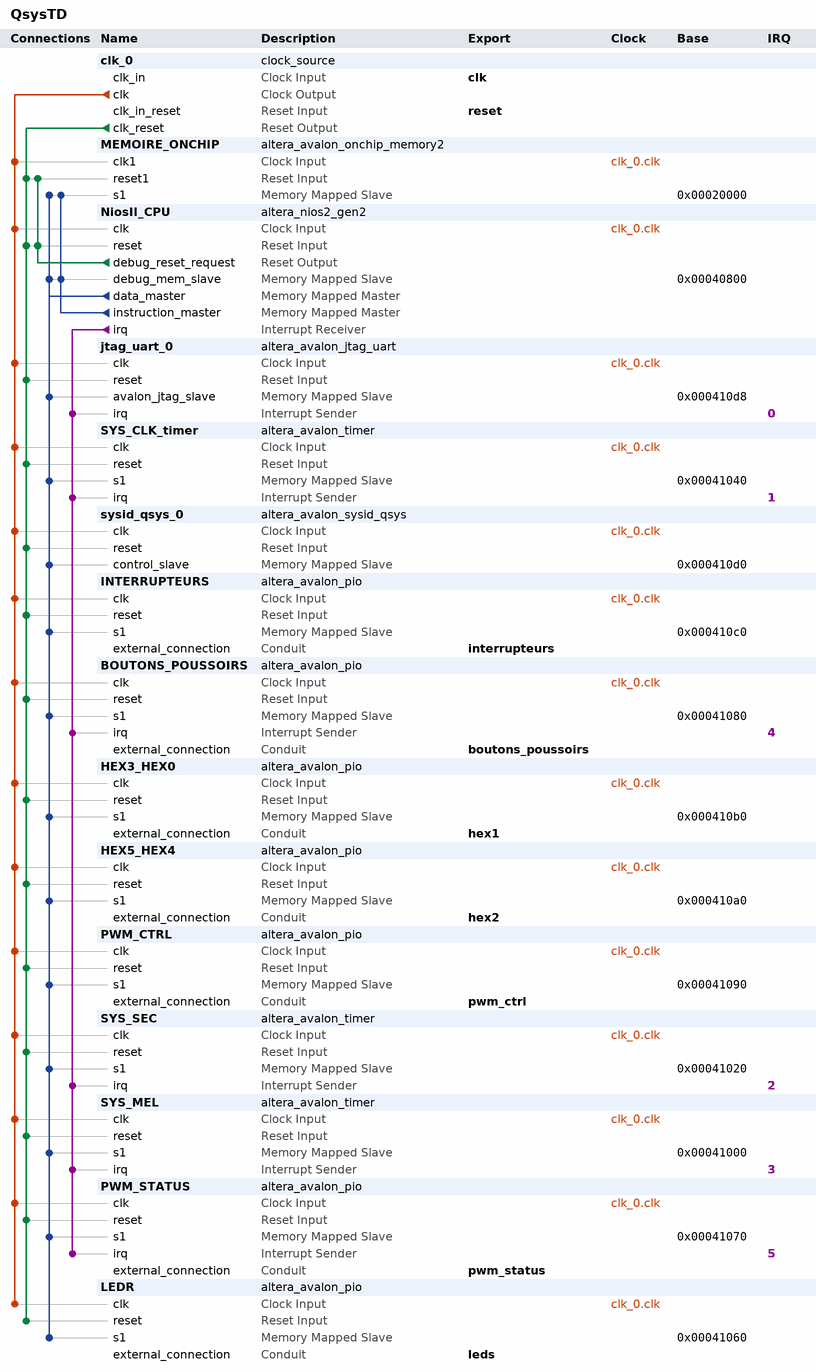
[diagram p0: system contents]
# Platform Designer (Qsys) system QsysTD, MAX 10 10M50DAF484C7G
# Parameters at their usual value, and those the tool derives, are not listed.
package require -exact qsys 18.1
create_system QsysTD
set_project_property DEVICE_FAMILY {MAX 10}
set_project_property DEVICE 10M50DAF484C7G

add_instance clk_0 clock_source 18.1
set_instance_parameter_value clk_0 clockFrequency 50000000

add_instance MEMOIRE_ONCHIP altera_avalon_onchip_memory2 18.1
set_instance_parameter_value MEMOIRE_ONCHIP dataWidth 32
set_instance_parameter_value MEMOIRE_ONCHIP dualPort false
set_instance_parameter_value MEMOIRE_ONCHIP initMemContent false
set_instance_parameter_value MEMOIRE_ONCHIP initializationFileName onchip_mem.hex
set_instance_parameter_value MEMOIRE_ONCHIP memorySize 122880

add_instance NiosII_CPU altera_nios2_gen2 18.1
set_instance_parameter_value NiosII_CPU dcache_size 0
set_instance_parameter_value NiosII_CPU exceptionSlave MEMOIRE_ONCHIP.s1
set_instance_parameter_value NiosII_CPU icache_size 2048
set_instance_parameter_value NiosII_CPU impl Fast
set_instance_parameter_value NiosII_CPU resetSlave MEMOIRE_ONCHIP.s1
set_instance_parameter_value NiosII_CPU setting_branchpredictiontype Static

add_instance jtag_uart_0 altera_avalon_jtag_uart 18.1
set_instance_parameter_value jtag_uart_0 simInteractiveOptions NO_INTERACTIVE_WINDOWS

add_instance SYS_CLK_timer altera_avalon_timer 18.1
set_instance_parameter_value SYS_CLK_timer period 1
set_instance_parameter_value SYS_CLK_timer periodUnits MSEC

add_instance sysid_qsys_0 altera_avalon_sysid_qsys 18.1
set_instance_parameter_value sysid_qsys_0 id 305419896

add_instance INTERRUPTEURS altera_avalon_pio 18.1
set_instance_parameter_value INTERRUPTEURS direction Input
set_instance_parameter_value INTERRUPTEURS width 10

add_instance BOUTONS_POUSSOIRS altera_avalon_pio 18.1
set_instance_parameter_value BOUTONS_POUSSOIRS captureEdge true
set_instance_parameter_value BOUTONS_POUSSOIRS direction Input
set_instance_parameter_value BOUTONS_POUSSOIRS edgeType FALLING
set_instance_parameter_value BOUTONS_POUSSOIRS generateIRQ true
set_instance_parameter_value BOUTONS_POUSSOIRS irqType EDGE
set_instance_parameter_value BOUTONS_POUSSOIRS width 2

add_instance HEX3_HEX0 altera_avalon_pio 18.1
set_instance_parameter_value HEX3_HEX0 direction Output
set_instance_parameter_value HEX3_HEX0 resetValue 4294967295
set_instance_parameter_value HEX3_HEX0 width 32

add_instance HEX5_HEX4 altera_avalon_pio 18.1
set_instance_parameter_value HEX5_HEX4 direction Output
set_instance_parameter_value HEX5_HEX4 resetValue 4294967295
set_instance_parameter_value HEX5_HEX4 width 32

add_instance PWM_CTRL altera_avalon_pio 18.1
set_instance_parameter_value PWM_CTRL direction Output
set_instance_parameter_value PWM_CTRL width 32

add_instance SYS_SEC altera_avalon_timer 18.1
set_instance_parameter_value SYS_SEC period 1
set_instance_parameter_value SYS_SEC periodUnits SEC

add_instance SYS_MEL altera_avalon_timer 18.1
set_instance_parameter_value SYS_MEL period 62.5
set_instance_parameter_value SYS_MEL periodUnits MSEC

add_instance PWM_STATUS altera_avalon_pio 18.1
set_instance_parameter_value PWM_STATUS captureEdge true
set_instance_parameter_value PWM_STATUS direction Input
set_instance_parameter_value PWM_STATUS generateIRQ true
set_instance_parameter_value PWM_STATUS irqType EDGE
set_instance_parameter_value PWM_STATUS width 8

add_instance LEDR altera_avalon_pio 18.1
set_instance_parameter_value LEDR direction Output
set_instance_parameter_value LEDR resetValue 1023
set_instance_parameter_value LEDR width 10

# connections
add_connection clk_0.clk BOUTONS_POUSSOIRS.clk clock
add_connection clk_0.clk HEX3_HEX0.clk clock
add_connection clk_0.clk HEX5_HEX4.clk clock
add_connection clk_0.clk INTERRUPTEURS.clk clock
add_connection clk_0.clk jtag_uart_0.clk clock
add_connection clk_0.clk LEDR.clk clock
add_connection clk_0.clk MEMOIRE_ONCHIP.clk1 clock
add_connection clk_0.clk NiosII_CPU.clk clock
add_connection clk_0.clk PWM_CTRL.clk clock
add_connection clk_0.clk PWM_STATUS.clk clock
add_connection clk_0.clk SYS_CLK_timer.clk clock
add_connection clk_0.clk SYS_MEL.clk clock
add_connection clk_0.clk SYS_SEC.clk clock
add_connection clk_0.clk sysid_qsys_0.clk clock
add_connection clk_0.clk_reset BOUTONS_POUSSOIRS.reset reset
add_connection clk_0.clk_reset HEX3_HEX0.reset reset
add_connection clk_0.clk_reset HEX5_HEX4.reset reset
add_connection clk_0.clk_reset INTERRUPTEURS.reset reset
add_connection clk_0.clk_reset jtag_uart_0.reset reset
add_connection clk_0.clk_reset LEDR.reset reset
add_connection clk_0.clk_reset MEMOIRE_ONCHIP.reset1 reset
add_connection clk_0.clk_reset NiosII_CPU.reset reset
add_connection clk_0.clk_reset PWM_CTRL.reset reset
add_connection clk_0.clk_reset PWM_STATUS.reset reset
add_connection clk_0.clk_reset SYS_CLK_timer.reset reset
add_connection clk_0.clk_reset SYS_MEL.reset reset
add_connection clk_0.clk_reset SYS_SEC.reset reset
add_connection clk_0.clk_reset sysid_qsys_0.reset reset
add_connection NiosII_CPU.debug_reset_request MEMOIRE_ONCHIP.reset1 reset
add_connection NiosII_CPU.debug_reset_request NiosII_CPU.reset reset
add_connection NiosII_CPU.data_master BOUTONS_POUSSOIRS.s1 avalon
set_connection_parameter_value NiosII_CPU.data_master/BOUTONS_POUSSOIRS.s1 baseAddress 0x00041080
add_connection NiosII_CPU.data_master HEX3_HEX0.s1 avalon
set_connection_parameter_value NiosII_CPU.data_master/HEX3_HEX0.s1 baseAddress 0x000410b0
add_connection NiosII_CPU.data_master HEX5_HEX4.s1 avalon
set_connection_parameter_value NiosII_CPU.data_master/HEX5_HEX4.s1 baseAddress 0x000410a0
add_connection NiosII_CPU.data_master INTERRUPTEURS.s1 avalon
set_connection_parameter_value NiosII_CPU.data_master/INTERRUPTEURS.s1 baseAddress 0x000410c0
add_connection NiosII_CPU.data_master jtag_uart_0.avalon_jtag_slave avalon
set_connection_parameter_value NiosII_CPU.data_master/jtag_uart_0.avalon_jtag_slave baseAddress 0x000410d8
add_connection NiosII_CPU.data_master LEDR.s1 avalon
set_connection_parameter_value NiosII_CPU.data_master/LEDR.s1 baseAddress 0x00041060
add_connection NiosII_CPU.data_master MEMOIRE_ONCHIP.s1 avalon
set_connection_parameter_value NiosII_CPU.data_master/MEMOIRE_ONCHIP.s1 baseAddress 0x00020000
add_connection NiosII_CPU.data_master NiosII_CPU.debug_mem_slave avalon
set_connection_parameter_value NiosII_CPU.data_master/NiosII_CPU.debug_mem_slave baseAddress 0x00040800
add_connection NiosII_CPU.data_master PWM_CTRL.s1 avalon
set_connection_parameter_value NiosII_CPU.data_master/PWM_CTRL.s1 baseAddress 0x00041090
add_connection NiosII_CPU.data_master PWM_STATUS.s1 avalon
set_connection_parameter_value NiosII_CPU.data_master/PWM_STATUS.s1 baseAddress 0x00041070
add_connection NiosII_CPU.data_master SYS_CLK_timer.s1 avalon
set_connection_parameter_value NiosII_CPU.data_master/SYS_CLK_timer.s1 baseAddress 0x00041040
add_connection NiosII_CPU.data_master SYS_MEL.s1 avalon
set_connection_parameter_value NiosII_CPU.data_master/SYS_MEL.s1 baseAddress 0x00041000
add_connection NiosII_CPU.data_master SYS_SEC.s1 avalon
set_connection_parameter_value NiosII_CPU.data_master/SYS_SEC.s1 baseAddress 0x00041020
add_connection NiosII_CPU.data_master sysid_qsys_0.control_slave avalon
set_connection_parameter_value NiosII_CPU.data_master/sysid_qsys_0.control_slave baseAddress 0x000410d0
add_connection NiosII_CPU.instruction_master MEMOIRE_ONCHIP.s1 avalon
set_connection_parameter_value NiosII_CPU.instruction_master/MEMOIRE_ONCHIP.s1 baseAddress 0x00020000
add_connection NiosII_CPU.instruction_master NiosII_CPU.debug_mem_slave avalon
set_connection_parameter_value NiosII_CPU.instruction_master/NiosII_CPU.debug_mem_slave baseAddress 0x00040800
add_connection NiosII_CPU.irq BOUTONS_POUSSOIRS.irq interrupt
set_connection_parameter_value NiosII_CPU.irq/BOUTONS_POUSSOIRS.irq irqNumber 4
add_connection NiosII_CPU.irq jtag_uart_0.irq interrupt
set_connection_parameter_value NiosII_CPU.irq/jtag_uart_0.irq irqNumber 0
add_connection NiosII_CPU.irq PWM_STATUS.irq interrupt
set_connection_parameter_value NiosII_CPU.irq/PWM_STATUS.irq irqNumber 5
add_connection NiosII_CPU.irq SYS_CLK_timer.irq interrupt
set_connection_parameter_value NiosII_CPU.irq/SYS_CLK_timer.irq irqNumber 1
add_connection NiosII_CPU.irq SYS_MEL.irq interrupt
set_connection_parameter_value NiosII_CPU.irq/SYS_MEL.irq irqNumber 3
add_connection NiosII_CPU.irq SYS_SEC.irq interrupt
set_connection_parameter_value NiosII_CPU.irq/SYS_SEC.irq irqNumber 2

# exported interfaces
add_interface boutons_poussoirs conduit end
set_interface_property boutons_poussoirs EXPORT_OF BOUTONS_POUSSOIRS.external_connection
add_interface clk clock sink
set_interface_property clk EXPORT_OF clk_0.clk_in
add_interface hex1 conduit end
set_interface_property hex1 EXPORT_OF HEX3_HEX0.external_connection
add_interface hex2 conduit end
set_interface_property hex2 EXPORT_OF HEX5_HEX4.external_connection
add_interface interrupteurs conduit end
set_interface_property interrupteurs EXPORT_OF INTERRUPTEURS.external_connection
add_interface leds conduit end
set_interface_property leds EXPORT_OF LEDR.external_connection
add_interface pwm_ctrl conduit end
set_interface_property pwm_ctrl EXPORT_OF PWM_CTRL.external_connection
add_interface pwm_status conduit end
set_interface_property pwm_status EXPORT_OF PWM_STATUS.external_connection
add_interface reset reset sink
set_interface_property reset EXPORT_OF clk_0.clk_in_reset

set_interconnect_requirement {$system} qsys_mm.clockCrossingAdapter HANDSHAKE
set_interconnect_requirement {$system} qsys_mm.enableEccProtection FALSE
set_interconnect_requirement {$system} qsys_mm.insertDefaultSlave FALSE
set_interconnect_requirement {$system} qsys_mm.maxAdditionalLatency 1

save_system QsysTD.qsys
